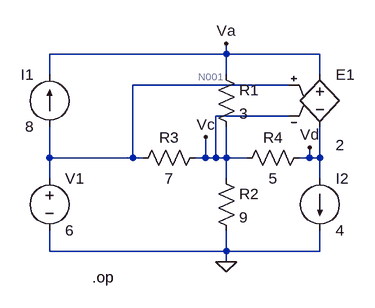
[diagram p0: schematic P_EX2-5.asc]
P_EX2-5.asc, the LTspice schematic file:
Version 4
SHEET 1 880 680
WIRE 144 16 144 0
WIRE 144 16 -128 16
WIRE 288 16 144 16
WIRE -128 48 -128 16
WIRE 144 48 144 16
WIRE 288 48 288 16
WIRE 240 64 0 64
WIRE 240 112 128 112
WIRE -128 176 -128 128
WIRE 0 176 0 64
WIRE 0 176 -128 176
WIRE 16 176 0 176
WIRE 112 176 112 144
WIRE 112 176 96 176
WIRE 128 176 128 112
WIRE 128 176 112 176
WIRE 144 176 144 128
WIRE 144 176 128 176
WIRE 176 176 144 176
WIRE 272 176 272 160
WIRE 272 176 256 176
WIRE 288 176 288 128
WIRE 288 176 272 176
WIRE -128 208 -128 176
WIRE 144 208 144 176
WIRE 288 208 288 176
WIRE -128 320 -128 288
WIRE 144 320 144 288
WIRE 144 320 -128 320
WIRE 288 320 288 288
WIRE 288 320 144 320
WIRE 144 336 144 320
FLAG 144 336 0
FLAG 144 0 Va
FLAG 112 144 Vc
FLAG 272 160 Vd
SYMBOL res 128 32 R0
SYMATTR InstName R1
SYMATTR Value 3
SYMBOL res 128 192 R0
SYMATTR InstName R2
SYMATTR Value 9
SYMBOL res 112 160 R90
WINDOW 0 0 56 VBottom 2
WINDOW 3 32 56 VTop 2
SYMATTR InstName R3
SYMATTR Value 7
SYMBOL res 272 160 R90
WINDOW 0 0 56 VBottom 2
WINDOW 3 32 56 VTop 2
SYMATTR InstName R4
SYMATTR Value 5
SYMBOL current -128 128 R180
WINDOW 0 24 80 Left 2
WINDOW 3 24 0 Left 2
WINDOW 123 0 0 Left 2
WINDOW 39 0 0 Left 2
SYMATTR InstName I1
SYMATTR Value 8
SYMBOL current 288 208 R0
WINDOW 123 0 0 Left 2
WINDOW 39 0 0 Left 2
SYMATTR InstName I2
SYMATTR Value 4
SYMBOL voltage -128 192 R0
WINDOW 123 0 0 Left 2
WINDOW 39 0 0 Left 2
SYMATTR InstName V1
SYMATTR Value 6
SYMBOL e 288 32 R0
WINDOW 3 24 96 Invisible 2
WINDOW 123 24 124 Left 2
SYMATTR InstName E1
SYMATTR Value ""
SYMATTR Value2 2
TEXT -62 360 Left 2 !.op

The netlist it stands for:
* P_EX2-5.asc
R1 Va Vc 3
R2 Vc 0 9
R3 Vc N001 7
R4 Vd Vc 5
I1 N001 Va 8
I2 Vd 0 4
V1 N001 0 6
E1 Va Vd N001 Vc 2
.op
.backanno
.end

* Results of the author's LTspice run, read from the files saved beside the schematic
* Operating Point:
*   V(va) = 16.78 V
*   V(vc) = 19.12 V
*   V(n001) = 6 V
*   V(vd) = 43.03 V
*   I(I2) = 4 A
*   I(I1) = 8 A
*   I(R4) = 4.781 A
*   I(R3) = 1.875 A
*   I(R2) = 2.125 A
*   I(R1) = -781.2 mA
*   I(E1) = 8.781 A
*   I(V1) = -6.125 A